# EAGLE design openTPM-v30 (EAGLE 8.1.1)
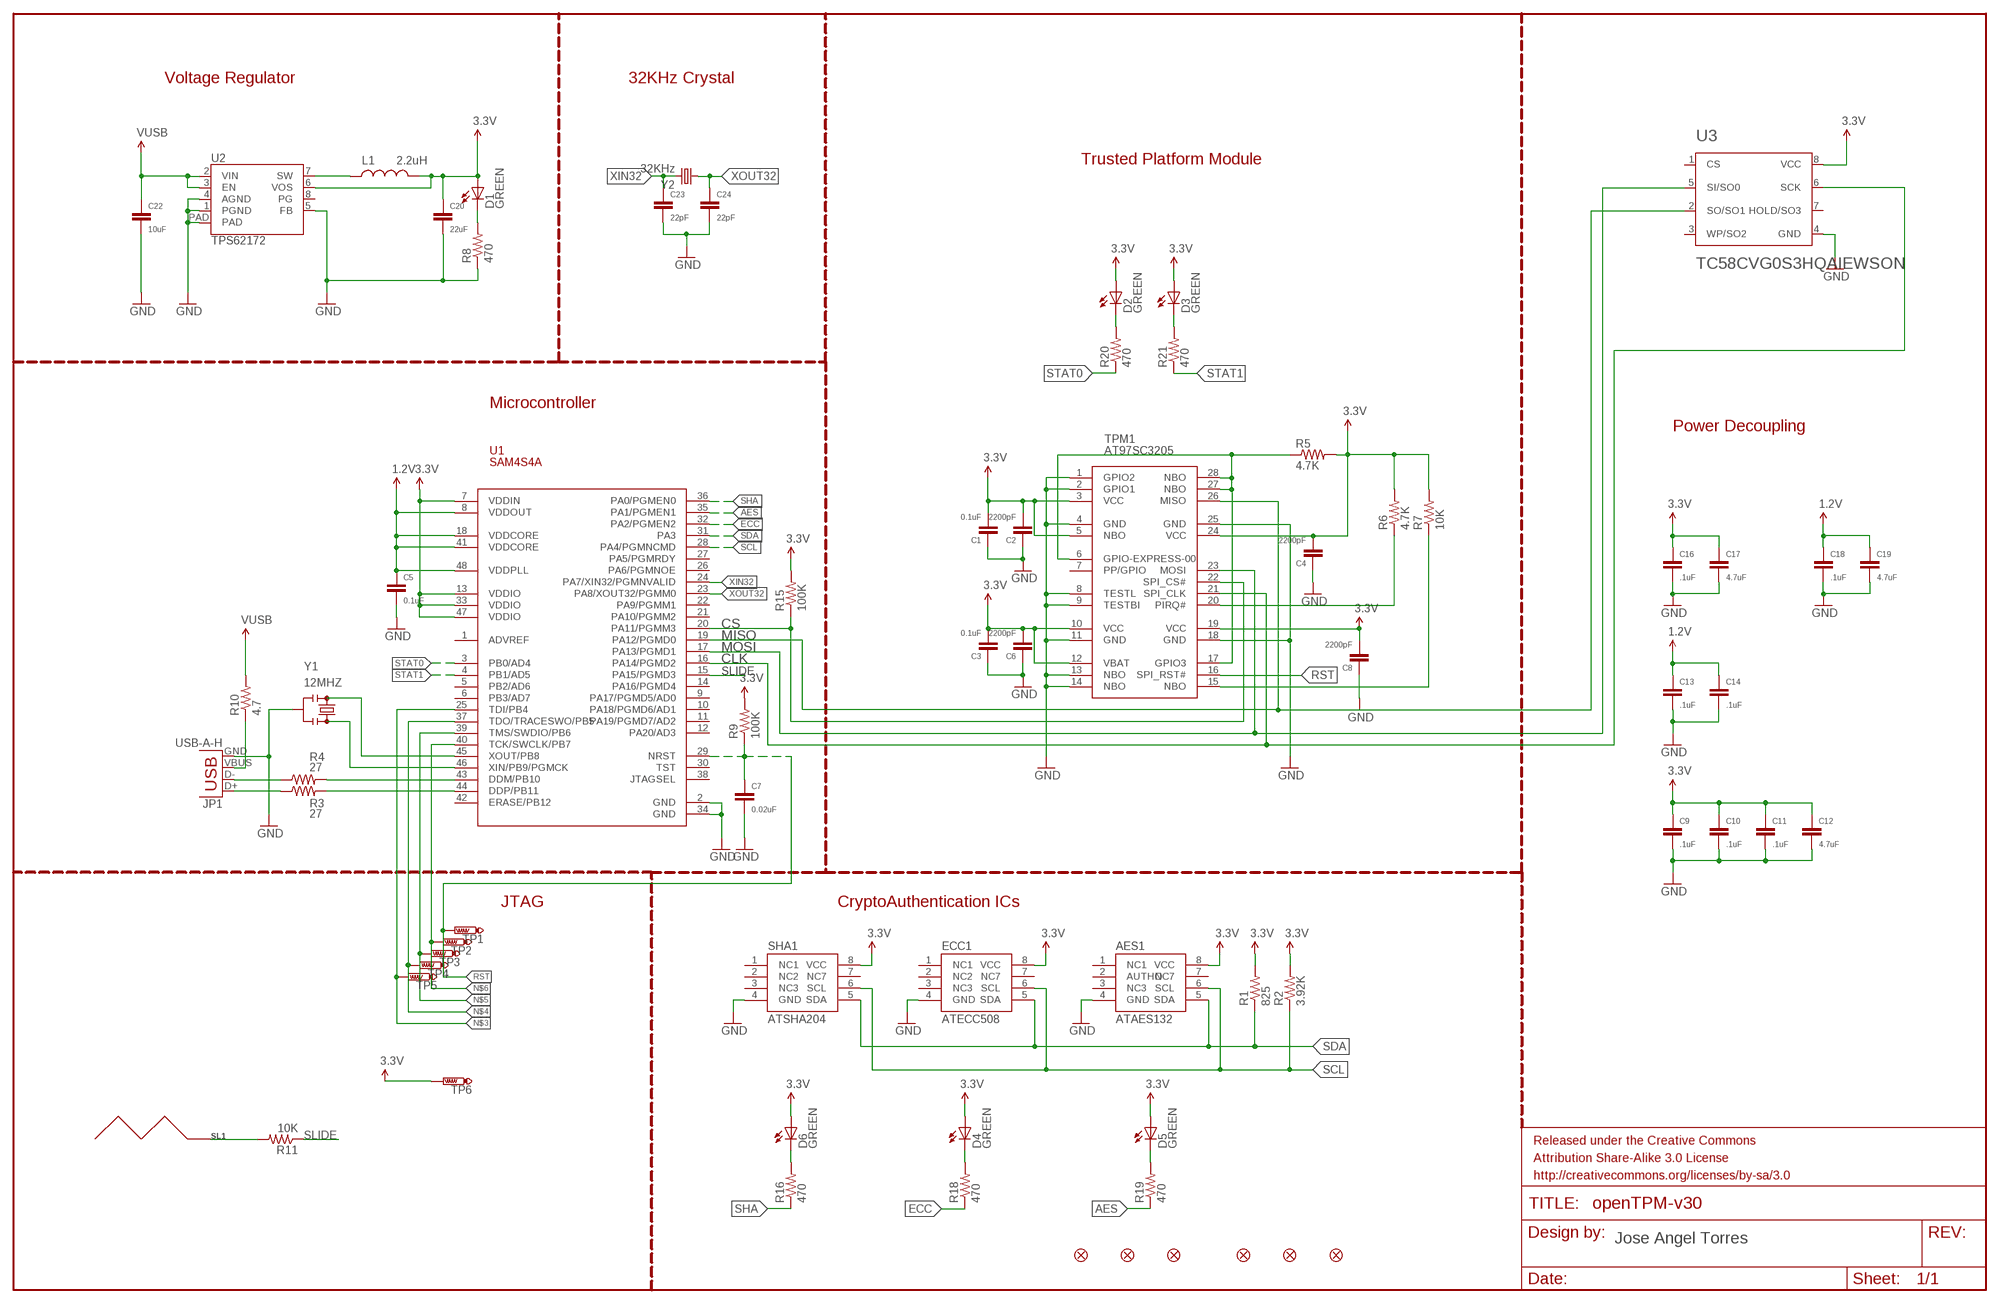
[diagram p0: schematic, sheet 1]

## Parts
AES1  ATAES132  CRYPTOTRONIX_ATAES132  [CRYPTOTRONIX_SOIC8]
C1  0.1uF  CAPACITOR.0402  [0402]
C2  2200pF  CAPACITOR.0402  [0402]
C3  0.1uF  CAPACITOR.0402  [0402]
C4  2200pF  CAPACITOR.0402  [0402]
C5  0.1uF  CAPACITOR.0402  [0402]
C6  2200pF  CAPACITOR.0402  [0402]
C7  0.02uF  CAPACITOR.0402  [0402]
C8  2200pF  CAPACITOR.0402  [0402]
C9  .1uF  CAPACITOR.0402  [0402]
C10  .1uF  CAPACITOR.0402  [0402]
C11  .1uF  CAPACITOR.0402  [0402]
C12  4.7uF  CAPACITOR.0402  [0402]
C13  .1uF  CAPACITOR.0402  [0402]
C14  .1uF  CAPACITOR.0402  [0402]
C16  .1uF  CAPACITOR.0402  [0402]
C17  4.7uF  CAPACITOR.0402  [0402]
C18  .1uF  CAPACITOR.0402  [0402]
C19  4.7uF  CAPACITOR.0402  [0402]
C20  22uF  CAPACITOR.0603  [0603]
C22  10uF  CAPACITOR.0402  [0402]
C23  22pF  CAPACITOR.0402  [0402]
C24  22pF  CAPACITOR.0402  [0402]
D1  GREEN  SPARKFUN-LED_LED-GREEN0603  [SPARKFUN-LED_LED-0603]
D2  GREEN  SPARKFUN-LED_LED-GREEN0603  [SPARKFUN-LED_LED-0603]
D3  GREEN  SPARKFUN-LED_LED-GREEN0603  [SPARKFUN-LED_LED-0603]
D4  GREEN  SPARKFUN-LED_LED-GREEN0603  [SPARKFUN-LED_LED-0603]
D5  GREEN  SPARKFUN-LED_LED-GREEN0603  [SPARKFUN-LED_LED-0603]
D6  GREEN  SPARKFUN-LED_LED-GREEN0603  [SPARKFUN-LED_LED-0603]
ECC1  ATECC508  [CRYPTOTRONIX_SOIC8]
FID1  SPARKFUN-AESTHETICS_FIDUCIAL1X2  [SPARKFUN-AESTHETICS_FIDUCIAL-1X2]
FID2  SPARKFUN-AESTHETICS_FIDUCIAL1X2  [SPARKFUN-AESTHETICS_FIDUCIAL-1X2]
FID3  SPARKFUN-AESTHETICS_FIDUCIAL1X2  [SPARKFUN-AESTHETICS_FIDUCIAL-1X2]
FID4  SPARKFUN-AESTHETICS_FIDUCIAL1X2  [SPARKFUN-AESTHETICS_FIDUCIAL-1X2]
FID5  SPARKFUN-AESTHETICS_FIDUCIAL1X2  [SPARKFUN-AESTHETICS_FIDUCIAL-1X2]
FID6  SPARKFUN-AESTHETICS_FIDUCIAL1X2  [SPARKFUN-AESTHETICS_FIDUCIAL-1X2]
JP1  USB-A-H  [USB-A-H]
L1  2.2uH  INDUCTOR0402  [C0402]
R1  825  RESISTOR.0402  [0402]
R2  3.92K  RESISTOR.0402  [0402]
R3  27  RESISTOR.0402  [0402]
R4  27  RESISTOR.0402  [0402]
R5  4.7K  RESISTOR.0402  [0402]
R6  4.7K  RESISTOR.0402  [0402]
R7  10K  RESISTOR.0402  [0402]
R8  470  RESISTOR.0402  [0402]
R9  100K  RESISTOR.0402  [0402]
R10  4.7  RESISTOR.0402  [0402]
R11  10K  RESISTOR.0402  [0402]
R15  100K  RESISTOR.0402  [0402]
R16  470  RESISTOR.0402  [0402]
R18  470  RESISTOR.0402  [0402]
R19  470  RESISTOR.0402  [0402]
R20  470  RESISTOR.0402  [0402]
R21  470  RESISTOR.0402  [0402]
SHA1  ATSHA204  CRYPTOTRONIX_ATSHA204  [CRYPTOTRONIX_SOIC8]
SL1  SLIDER_PASSIVE_1SEG  [SLIDER_PASSIVE_1SEG_12MM]
TP1  PTR1B1,27  [B1,27]
TP2  PTR1B1,27  [B1,27]
TP3  PTR1B1,27  [B1,27]
TP4  PTR1B1,27  [B1,27]
TP5  PTR1B1,27  [B1,27]
TP6  PTR1B1,27  [B1,27]
TPM1  AT97SC3205  [TSSOP28]
U1  SAM4S4A  [LQFP-48]
U2  TPS62172  [WSON-8-PAD]
U3  TC58CVG0S3HQAIEWSON  [WSON-8-PAD]
Y1  12MHZ  RESONATOR12MHZ  [RESONATOR-SMD]
Y2  32KHz  CRYSTALEPSONMC146  [CRYSTAL-32KHZ-SMD_EPSON_MC146]

## Nets
1.2V: C5.1 C13.1 C14.1 C18.1 C19.1 U1.8(VDDOUT) U1.18(VDDCORE) U1.41(VDDCORE) U1.48(VDDPLL)
3.3V: AES1.8(VCC) C1.2 C2.2 C3.2 C4.2 C6.2 C8.2 C9.1 C10.1 C11.1 C12.1 C16.1 C17.1 C20.1 D1.A D2.A D3.A D4.A D5.A D6.A ECC1.8(VCC) L1.2 R1.2 R2.2 R5.2 R6.2 R7.2 R9.2 R15.2 SHA1.8(VCC) TP6.TP TPM1.3(VCC) TPM1.5(NBO) TPM1.10(VCC) TPM1.12(VBAT) TPM1.19(VCC) TPM1.24(VCC) U1.7(VDDIN) U1.13(VDDIO) U1.33(VDDIO) U1.47(VDDIO) U2.6(VOS) U3.8(VCC)
AES: R19.1 U1.35(PA1/PGMEN1)
CLK: TPM1.21(SPI_CLK) U1.16(PA14/PGMD2) U3.6(SCK)
CS: R15.1 TPM1.22(SPI_CS#) U1.20(PA11/PGMM3)
ECC: R18.1 U1.32(PA2/PGMEN2)
GND: AES1.4(GND) C1.1 C2.1 C3.1 C4.1 C5.2 C6.1 C7.2 C8.1 C9.2 C10.2 C11.2 C12.2 C13.2 C14.2 C16.2 C17.2 C18.2 C19.2 C20.2 C22.2 C23.2 C24.2 ECC1.4(GND) JP1.GND R8.1 SHA1.4(GND) TPM1.1(GPIO2) TPM1.2(GPIO1) TPM1.4(GND) TPM1.8(TESTL) TPM1.9(TESTBI) TPM1.11(GND) TPM1.13(NBO) TPM1.14(NBO) TPM1.18(GND) TPM1.25(GND) U1.2(GND) U1.34(GND) U2.1(PGND) U2.4(AGND) U2.5(FB) U2.PAD U3.4(GND) Y1.2
MISO: TPM1.26(MISO) U1.19(PA12/PGMD0) U3.2(SO/SO1)
MOSI: TPM1.23(MOSI) U1.17(PA13/PGMD1) U3.5(SI/SO0)
N$1: R4.2 U1.43(DDM/PB10)
N$2: R3.2 U1.44(DDP/PB11)
N$3: TP5.TP U1.25(TDI/PB4)
N$4: TP4.TP U1.37(TDO/TRACESWO/PB5)
N$5: TP3.TP U1.39(TMS/SWDIO/PB6)
N$6: TP2.TP U1.40(TCK/SWCLK/PB7)
N$7: R11.2 SL1.S1(SL1)
N$8: U1.45(XOUT/PB8) Y1.1
N$9: U1.46(XIN/PB9/PGMCK) Y1.3
N$10: R6.1 TPM1.20(PIRQ#)
N$11: JP1.D- R4.1
N$12: JP1.D+ R3.1
N$13: JP1.VBUS R10.1
N$14: R7.1 TPM1.15(NBO)
N$15: R5.1 TPM1.6(GPIO-EXPRESS-00) TPM1.17(GPIO3) TPM1.27(NBO) TPM1.28(NBO)
N$16: D4.C R18.2
N$17: L1.1 U2.7(SW)
N$18: D1.C R8.2
N$20: D6.C R16.2
N$21: D5.C R19.2
N$22: D2.C R20.2
N$23: D3.C R21.2
RST: C7.1 R9.1 TP1.TP TPM1.16(SPI_RST#) U1.29(NRST)
SCL: AES1.6(SCL) ECC1.6(SCL) R2.1 SHA1.6(SCL) U1.28(PA4/PGMNCMD)
SDA: AES1.5(SDA) ECC1.5(SDA) R1.1 SHA1.5(SDA) U1.31(PA3)
SHA: R16.1 U1.36(PA0/PGMEN0)
SLIDE: R11.1 U1.15(PA15/PGMD3)
STAT0: R20.1 U1.3(PB0/AD4)
STAT1: R21.1 U1.4(PB1/AD5)
VUSB: C22.1 R10.2 U2.2(VIN) U2.3(EN)
XIN32: C23.1 U1.24(PA7/XIN32/PGMNVALID) Y2.P$1
XOUT32: C24.1 U1.23(PA8/XOUT32/PGMM0) Y2.P$2
Unconnected: AES1.1(NC1) AES1.2(AUTHO) AES1.3(NC3) AES1.7(NC7) ECC1.1(NC1) ECC1.2(NC2) ECC1.3(NC3) ECC1.7(NC7) SHA1.1(NC1) SHA1.2(NC2) SHA1.3(NC3) SHA1.7(NC7) TPM1.7(PP/GPIO) U1.1(ADVREF) U1.5(PB2/AD6) U1.6(PB3/AD7) U1.9(PA17/PGMD5/AD0) U1.10(PA18/PGMD6/AD1) U1.11(PA19/PGMD7/AD2) U1.12(PA20/AD3) U1.14(PA16/PGMD4) U1.21(PA10/PGMM2) U1.22(PA9/PGMM1) U1.26(PA6/PGMNOE) U1.27(PA5/PGMRDY) U1.30(TST) U1.38(JTAGSEL) U1.42(ERASE/PB12) U2.8(PG) U3.1(CS) U3.3(WP/SO2) U3.7(HOLD/SO3)

## Notes on the sheet
- Voltage Regulator | 32KHz Crystal
- Trusted Platform Module
- Microcontroller
- Power Decoupling
- JTAG | CryptoAuthentication ICs
- Jose Angel Torres

## Library data of the parts
AES1 = TPM:CRYPTOTRONIX_ATAES132: 32Kb Serial EEPROM. AES-128-CCM. MAC. Secure Storage for 128-bit keys. Encrypted User Memory Readn and Write. HWRNG. 2.5V to 5.5V.
C1-C14 C16-C20 C22-C24 = TPM:CAPACITOR
D1-D6 = TPM:SPARKFUN-LED_LED-GREEN: Various green LEDs 0603- DIO-00821 LARGE- DIO-00862 LILYPAD- DIO-09910; PROD_ID: DIO-00821
ECC1 = TPM:ATECC508: ATECC108: Provides ECDSA with NIST curves P256, B283, and K283. Also, a RNG, 8.5Kb EEPROM. 2.0V - 5.5V.
FID1-FID6 = TPM:SPARKFUN-AESTHETICS_FIDUCIAL: Fiducial Alignment Points Various fiducial points for machine vision alignment.
JP1 = TPM:USB: USB Connectors USB-B-PTH is fully proven SKU : PRT-00139/CONN-08278 USB-miniB is fully proven SKU : PRT-00587 USB-A-PCB is untested. USB-A-H is throughly reviewed, but untested. Spark Fun Electronics SKU : PRT-00437 USB-B-SMT is throughly reviewed, but untested. Needs silkscreen touching up. USB-A-S has not been used/tested USB-MB-H has not been used/tested USB-MICROB has been used. CONN-09505; PROD_ID: CONN-08367
L1 = TPM:INDUCTOR: Inductors Basic Inductor/Choke - 0603 and 1206. Footprints are not proven and vary greatly between part numbers. INDUCTOR POWER 3.3UH 4.0A SMD 0.197" L x 0.197" W x 0.177" H (5.00mm x 5.00mm x 4.50mm)
R1-R11 R15 R16 R18-R21 = TPM:RESISTOR
SHA1 = TPM:CRYPTOTRONIX_ATSHA204: ATSHA204
SL1 = u2ftoken:SLIDER_PASSIVE_1SEG: Slider, Passive Touch/Capacitive Sensing Type, One (1) Segment Source : http://www.PatternAgents.com Github : https://github.com/PatternAgents License : http://creativecommons.org/licenses/by-sa/3.1/ (Creative Commons 3.1) THIS SOFTWARE IS PROVIDED BY THE CONTRIBUTORS "AS IS" AND WITHOUT ANY EXPRESS OR IMPLIED WARRANTIES, INCLUDING, BUT NOT LIMITED TO, THE IMPLIED WARRANTIES OF MERCHANTABILITY AND FITNESS FOR A PARTICULAR PURPOSE ARE DISCLAIMED. IN NO EVENT SHALL THE COPYRIGHT OWNER OR CONTRIBUTORS BE LIABLE FOR ANY DIRECT, INDIRECT, INCIDENTAL, SPECIAL, EXEMPLARY, OR CONSEQUENTIAL DAMAGES (INCLUDING, BUT NOT LIMITED TO, PROCUREMENT OF SUBSTITUTE GOODS OR SERVICES; LOSS OF USE, DATA, OR PROFITS; OR BUSINESS INTERRUPTION) HOWEVER CAUSED AND ON ANY THEORY OF LIABILITY, WHETHER IN CONTRACT, STRICT LIABILITY, OR TORT (INCLUDING NEGLIGENCE OR OTHERWISE) ARISING IN ANY WAY OUT OF THE USE OF THIS SOFTWARE, EVEN IF ADVISED OF THE POSSIBILITY OF SUCH DAMAGE.
TP1-TP6 = CHEEPER-REV0.51A:PTR1: TEST PIN
TPM1 = TPM:AT97SC3205: Atmel TPM 1.2
U1 = TPM:SAM4S4A
U2 = TPM:TPS62172: Texas Instruments TPS62172 3-17V 0.5A Step-Down Converter with DCS control. Available in adjustable and fixed output voltage versions. Is packaged in an 8-pin WSON package measuring 2 × 2 mm (DSG). See a 3.3V fixed output version of this chip in action on the Electric Imp Breakout Board <https://www.sparkfun.com/products/11400>. Datasheet <http://www.ti.com/lit/gpn/tps62172>; PROD_ID: IC-11307
U3 = ALLEYBEACH_LIB:TC58CVG0S3HQAIE
Y1 = TPM:RESONATOR: Resonator Small SMD resonator. Used, eg, on the Arduino Pro/ Pro Mini boards. 8MHz- XTAL-08895 16MHz- XTAL-08900; PROD_ID: XTAL-08900; VALUE: 16MHZ
Y2 = TPM:CRYSTAL: Various standard crystals. Proven footprints.

## Board
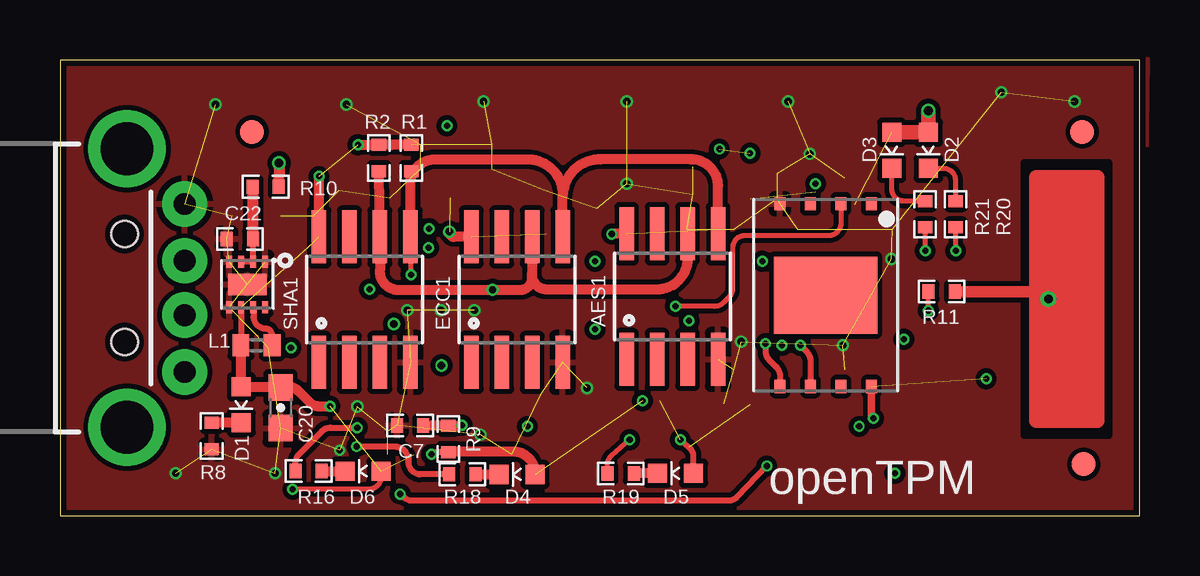
[diagram p1: board, top side]
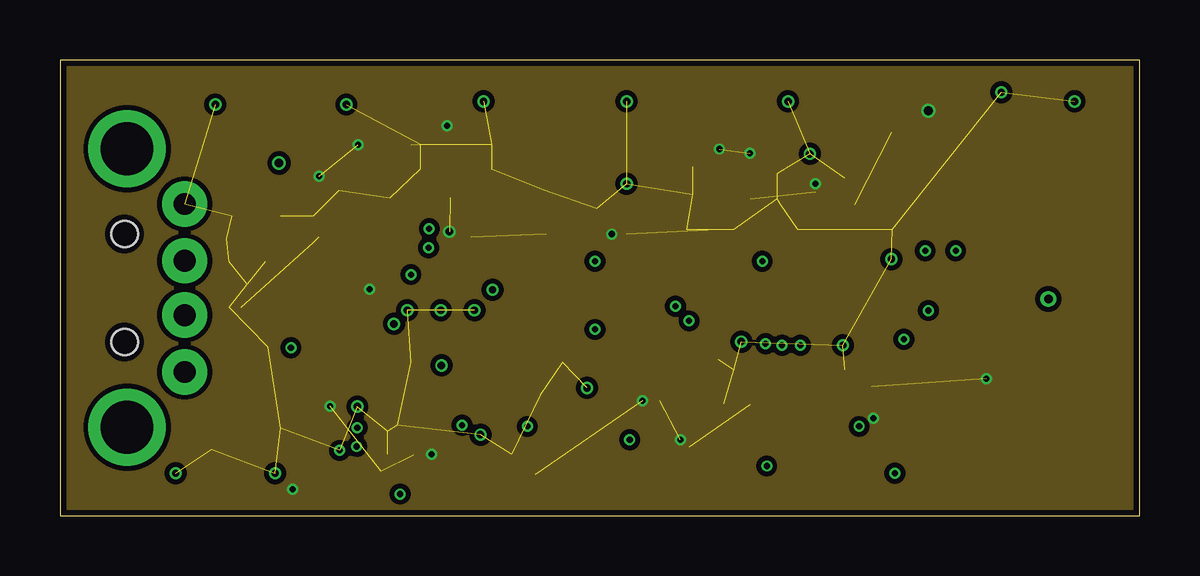
[diagram p2: board, inner layer Route2]
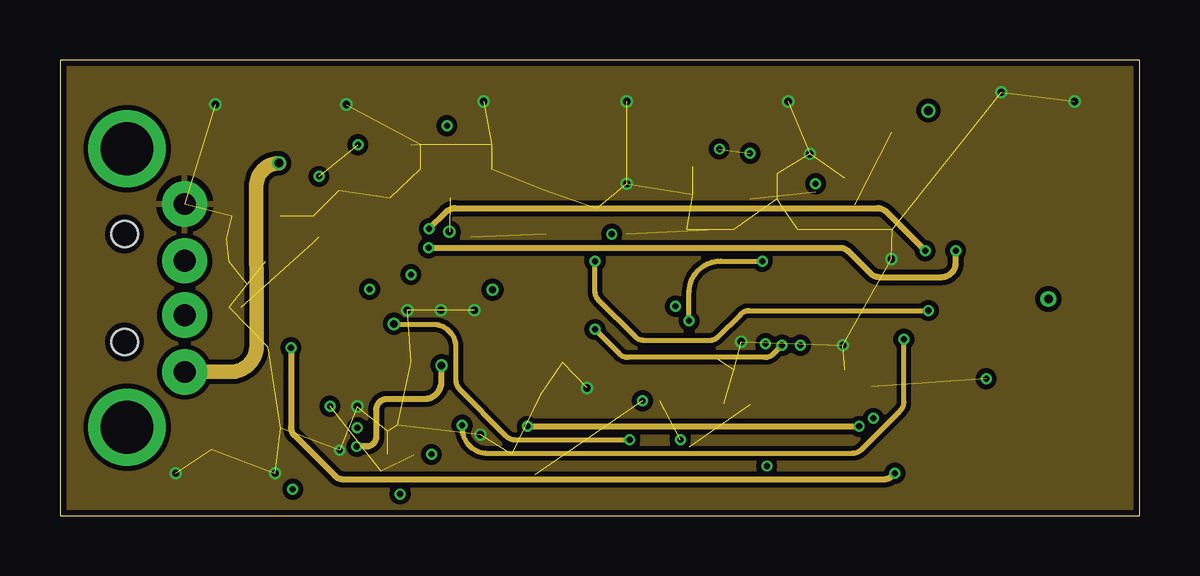
[diagram p3: board, inner layer Route15]
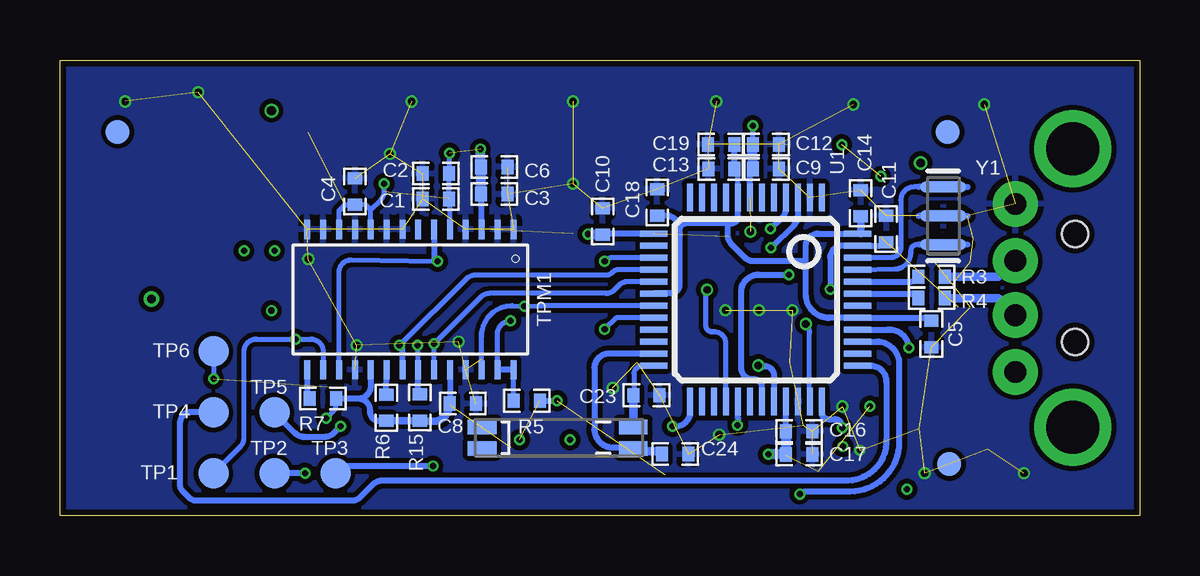
[diagram p4: board, bottom side, seen from below]

Size 45.01 x 19 mm. Coordinates in mm from the lower left corner, seen from the top.
Outline: 0,0 45.01,0 45.01,19 0,19 0,0
Copper layers (1*2*15*16): Top 0.035mm / dielectric 0.2mm / Route2 0.0175mm / dielectric 0.3mm / Route15 0.0175mm / dielectric 0.2mm / Bottom 0.035mm
Design rules "SeeedStudio_4layer_DRU_no_angle_20140221 *": minimum track width 8mil, minimum drill 10mil, track to track 8mil, track to pad 8mil, pad to pad 8mil, via to via 8mil, smd to smd 0mil, copper to edge 10mil, drill to drill 8mil, minimum pad ring 6mil, minimum via ring 4mil, stop-mask expansion 4mil, vias tented up to drill 100mil, thermal gap 10mil

### Footprints (pad centres in the part's own frame; a part is rotated, then mirrored left to right if it is on the bottom)
CRYPTOTRONIX_SOIC8 = smd 0.61 x 2.21: 1 -1.905,-2.616; 2 -0.635,-2.616; 3 0.635,-2.616; 4 1.905,-2.616; 5 1.905,2.616; 6 0.635,2.616; 7 -0.635,2.616; 8 -1.905,2.616
0402 = smd 0.5 x 0.6: 1 -0.55,0; 2 0.55,0
0603 = smd 1.1 x 1: 1 -0.85,0; 2 0.85,0
SPARKFUN-LED_LED-0603 = smd 0.8 x 0.8: A 0,-0.75; C 0,0.75
SPARKFUN-AESTHETICS_FIDUCIAL-1X2 = smd 1 x 1: 1 0,0
USB-A-H = drill 0.914 pad 1.88: D+ 2.4,1.127; D- 2.4,-1.127; GND 2.4,3.5; VBUS 2.4,-3.5 | drill 2.2: GND2 0,-5.8; GND3 0,5.8 | hole 1.1: -0.1,2.25; -0.1,-2.25
C0402 = smd 0.7 x 0.9: 1 -0.65,0; 2 0.65,0
SLIDER_PASSIVE_1SEG_12MM = drill 0.356: S1 0,-0.508
B1,27 = smd 1.27 x 1.27: TP 0,0
TSSOP28 = smd 0.8 x 0.25: 1 -2.921,4.623; 2 -2.921,3.962; 3 -2.921,3.302; 4 -2.921,2.642; 5 -2.921,1.981; 6 -2.921,1.321; 7 -2.921,0.66; 8 -2.927,0; 9 -2.921,-0.66; 10 -2.921,-1.321; 11 -2.921,-1.981; 12 -2.921,-2.642; 13 -2.921,-3.302; 14 -2.921,-3.962; 15 2.921,-3.962; 16 2.921,-3.302; 17 2.921,-2.642; 18 2.921,-1.981; 19 2.921,-1.321; 20 2.921,-0.66; 21 2.927,0; 22 2.921,0.66; 23 2.921,1.321; 24 2.921,1.981; 25 2.921,2.642; 26 2.921,3.302; 27 2.921,3.962; 28 2.921,4.623
LQFP-48 = smd 0.254 x 1.143: 1 -2.75,-4.25; 2 -2.25,-4.25; 3 -1.75,-4.25; 4 -1.25,-4.25; 5 -0.75,-4.25; 6 -0.25,-4.25; 7 0.25,-4.25; 8 0.75,-4.25; 9 1.25,-4.25; 10 1.75,-4.25; 11 2.25,-4.25; 12 2.75,-4.25; 25 2.75,4.25; 26 2.25,4.25; 27 1.75,4.25; 28 1.25,4.25; 29 0.75,4.25; 30 0.25,4.25; 31 -0.25,4.25; 32 -0.75,4.25; 33 -1.25,4.25; 34 -1.75,4.25; 35 -2.25,4.25; 36 -2.75,4.25 | smd 1.143 x 0.254: 13 4.25,-2.75; 14 4.25,-2.25; 15 4.25,-1.75; 16 4.25,-1.25; 17 4.25,-0.75; 18 4.25,-0.25; 19 4.25,0.25; 20 4.25,0.75; 21 4.25,1.25; 22 4.25,1.75; 23 4.25,2.25; 24 4.25,2.75; 37 -4.25,2.75; 38 -4.25,2.25; 39 -4.25,1.75; 40 -4.25,1.25; 41 -4.25,0.75; 42 -4.25,0.25; 43 -4.25,-0.25; 44 -4.25,-0.75; 45 -4.25,-1.25; 46 -4.25,-1.75; 47 -4.25,-2.25; 48 -4.25,-2.75
WSON-8-PAD = smd 0.25 x 0.5: 1 -0.75,-0.95; 2 -0.25,-0.95; 3 0.25,-0.95; 4 0.75,-0.95; 5 0.75,0.95; 6 0.25,0.95; 7 -0.25,0.95; 8 -0.75,0.95 | smd 1.6 x 0.9: PAD 0,0
WSON-8-PAD' = smd 0.45 x 0.55: 1 -1.905,-3.81; 2 -0.635,-3.81; 3 0.635,-3.81; 4 1.905,-3.81; 5 1.905,3.81; 6 0.635,3.81; 7 -0.635,3.81; 8 -1.905,3.81 | smd 4.3 x 3.2: PAD 0,0
RESONATOR-SMD = smd 0.45 x 1.905: 1 -1.2,0; 2 0,0; 3 1.2,0
CRYSTAL-32KHZ-SMD_EPSON_MC146 = smd 1.2 x 0.6: NC1 6.9,1.2; NC2 6.9,0.3; P$1 0.6,0.3; P$2 0.6,1.2

### Placement (x,y rotation side)
AES1  25.53,9.14 0 top
C1  29.34,13.21 0 bottom
C2  29.34,14.26 0 bottom
C3  26.91,13.41 180 bottom
C4  32.72,13.53 270 bottom
C5  8.69,7.58 270 bottom
C6  26.91,14.54 180 bottom
C7  14.59,3.77 180 top
C8  28.22,4.69 180 bottom
C9  15.58,14.47 0 bottom
C10  22.39,12.27 90 bottom
C11  10.57,11.96 90 bottom
C12  15.58,15.48 0 bottom
C13  17.44,14.47 180 bottom
C14  11.63,13.03 90 bottom
C16  14.2,3.53 0 bottom
C17  14.2,2.57 0 bottom
C18  20.12,13.07 90 bottom
C19  17.45,15.48 180 bottom
C20  9.19,4.51 270 top
C22  7.49,11.54 180 top
C23  20.56,5.03 0 bottom
C24  19.37,2.58 0 bottom
D1  7.56,4.64 180 top
D2  36.2,15.24 180 top
D3  34.67,15.24 180 top
D4  19.05,1.73 90 top
D5  25.65,1.78 90 top
D6  12.64,1.87 90 top
ECC1  19.05,9.02 0 top
FID1  42.61,16 0 top
FID2  8,16 0 top
FID3  42.67,2.16 0 top
FID4  8,16 0 bottom
FID5  7.94,2.16 0 bottom
FID6  42.61,16 0 bottom
JP1  2.79,9.5 0 top
L1  8.19,7.11 180 top
R1  14.64,14.92 90 top
R2  13.3,14.92 90 top
R3  8.67,9.97 180 bottom
R4  8.67,9.08 180 bottom
R5  25.55,4.8 0 bottom
R6  31.41,4.51 270 bottom
R7  34.05,4.89 0 bottom
R8  6.32,3.33 90 top
R9  16.18,3.21 270 top
R10  8.57,13.72 180 top
R11  36.75,9.35 0 top
R15  30.01,4.52 270 bottom
R16  10.36,1.87 0 top
R18  16.78,1.74 0 top
R19  23.37,1.78 0 top
R20  37.34,12.57 90 top
R21  36.07,12.57 90 top
SHA1  12.7,9.02 0 top
SL1  40.69,9.04 90 top
TP1  38.61,1.78 270 bottom
TP2  36.07,1.78 270 bottom
TP3  33.53,1.78 270 bottom
TP4  38.61,4.32 270 bottom
TP5  36.07,4.32 270 bottom
TP6  38.61,6.86 0 bottom
TPM1  30.73,9.02 270 bottom
U1  16,9.02 180 bottom
U2  7.81,9.65 180 top
U3  TC58CVG0S3HQAIEWSON  [WSON-8-PAD']  31.92,9.2 180 top
Y1  8.19,12.51 90 bottom
Y2  20.51,4.01 180 bottom

### Tracks (layer width: path | path; a pad name or v marks a point on that pad's centre or on a via)
1.2V
  Bottom 0.203: U1.18 arc-90 U1.18 | 8.91,8.27 C5.1 | 11.77,8.26 U1.41 | U1.8 16.75,14.14 arc-45 C13.1
  Bottom 0.254: 19.18,11.94 19.18,9.65 arc90 19.56,9.27 U1.18 | U1.41 8.91,8.27 | 13.92,10.62 13.92,11.26 arc90 13.41,11.77 U1.48 11.63,11.77 | 11.77,8.26 12.94,8.26 arc90 13.92,9.23 13.92,10.62 | U1.8 16.75,12.46 arc90 17.02,12.19 17.17,12.19 | 17.17,12.19 18.92,12.19 arc-90 19.18,11.94 | 13.92,10.62 16.1,10.62 arc45 16.46,10.77 17.02,11.33 arc45 17.17,11.69 17.17,12.19 | 16.93,14.44 C13.1 16.89,15.47 C19.1 | 19.18,11.94 arc-90 19.76,12.52 C18.1
  Bottom 0.305: C14.1 11.63,11.77
3.3V  (via drill 0.25, 0.3, 0.38)  (16 unrouted)
  Top 0.203: 9.31,5.39 C20.1 9.2,5.38 | 7.56,7.1 L1.2 7.56,7.13 | 16.18,2.69 arc-90 R9.2 | 23.04,11.76 arc90 v23,11.75 | D6.A 13.39,1.63 arc-90 12.88,1.12 v9.7,1.12 | 33.82,4.15 v33.91,4.06
  Top 0.254: U2.6 7.56,7.13 | D5.A 26.4,2.47 arc49 26.23,2.86 v25.86,3.17 | R9.2 15.72,2.66 arc45 v15.48,2.56
  Top 0.305: U3.8 33.82,4.15
  Top 0.406: 9.31,5.39 D1.A 7.56,7.1 | 16.18,2.69 18.91,2.69 arc-90 D4.A | R1.2 13.84,15.46 R2.2 v12.42,15.47 | AES1.8 23.04,11.76 | SHA1.8 v10.79,14.15 | 9.2,5.38 9.54,5.38 arc-45 9.9,5.24 10.42,4.72 arc45 10.78,4.57 v11.25,4.57 | ECC1.8 16.41,11.63 arc-90 16.26,11.79 arc45 v16.23,11.85
  Top 0.61: D3.A D2.A v36.2,16.89
  Bottom 0.203: C8.2 28.75,4.78 28.77,4.76 | 14.74,2.52 arc90 C17.1 | 14.74,4.75 arc-90 U1.33 | TPM1.5 28.75,13.2 arc-90 C1.2 C2.2 28.76,15.11 v28.77,15.11 | 16.25,14.4 arc-90 C9.1 | 16.14,15.32 arc90 C12.1 16.13,16.25 arc45 v16.13,16.26 | 27.43,13.2 arc-90 C3.2 | 10.83,11.27 C11.1 | TPM1.12 33.38,12.72 33.13,12.98 C4.2 32.28,12.98 32.05,12.75 | TPM1.10 32.05,12.75 | 32.05,12.75 31.64,13.16 arc-45 31.5,13.52 v31.5,13.84 | R7.2 33.5,4.68 arc45 33.65,4.33 v33.91,4.06 | TP6.TP v38.61,5.71
  Bottom 0.254: TPM1.24 28.75,4.78 | C16.1 14.74,4.75 | U1.7 16.25,14.4 | TPM1.19 32.05,5.41 arc90 32.58,4.89 | 32.58,4.89 R7.2 | TPM1.3 27.43,13.2 | R5.2 v24.28,4.8 | 10.83,11.27 U1.47 12.39,11.27 arc-90 12.9,10.76 v12.9,9.45 | U1.13 22.39,11.77 C10.1 | R6.2 31.7,3.96 arc90 32.08,4.34 32.08,4.39 arc-90 32.58,4.89
  Bottom 0.305: C8.2 28.77,4.63 arc90 29.46,3.94 29.98,3.94 arc90 R15.2 31.37,3.97 arc-90 R6.2
  Bottom 0.406: C16.1 14.74,2.52 | C9.1 16.14,15.32 | C17.1 v15.48,2.56 | v27.48,15.29 27.48,14.34 C6.2 C3.2 | C10.1 23,11.72 v23,11.75
  pour Route2: 0,19.05 0,0 45.09,0 45.09,1.4 45.09,19.05
AES  (via drill 0.25, 0.3)
  Top 0.203: v23.75,3.17 22.98,2.51 arc49 22.81,2.13 R19.1
  Route15 0.203: v23.75,3.17 18.96,3.17 arc-45 18.6,3.33 16.66,5.29 arc-45 16.51,5.64 16.51,7.02 arc90 15.56,7.98 13.98,7.98 arc-45 v13.92,8
  Bottom 0.203: U1.35 arc90 13.77,4.78 13.77,7.64 arc-45 v13.92,8
CLK  (via drill 0.25)
  Top 0.254: v30.86,7.11 31.14,6.84 arc-45 31.28,6.48 U3.6
  Bottom 0.203: U1.16 21.74,10.27 arc-45 22,10.13 arc45 22.24,10.03 27.7,10.03 arc-45 28.06,9.88 v30.86,7.11
  Bottom 0.254: TPM1.21 30.73,6.99 v30.86,7.11
CS  (via drill 0.25)
  Route15 0.203: v30.1,7.11 29.74,6.75 arc-45 29.38,6.6 23.68,6.6 arc-45 23.32,6.75 v22.3,7.77
  Bottom 0.203: 30.07,5.32 arc-90 R15.1 | U1.20 21.81,8.27 v22.3,7.77 | TPM1.22 30.07,7.09 v30.1,7.11
  Bottom 0.254: 30.07,5.32 TPM1.22
ECC  (via drill 0.25, 0.3)
  Top 0.254: R18.1 15.02,1.74 arc-90 14.53,2.23 14.53,2.31 arc90 13.95,2.9 v12.37,2.9
  Route15 0.254: v15.9,6.27 15.9,5.59 arc-90 15.19,4.88 13.64,4.88 arc90 13.18,4.42 13.18,3.3 arc-90 12.78,2.9 v12.37,2.9
  Bottom 0.203: U1.32 arc90 U1.32
  Bottom 0.254: v15.9,6.27 15.65,6.25 arc90 15.24,5.84 U1.32
GND  (via drill 0.25, 0.3)  (65 unrouted)
  other vias: 32.64,7.11 28.4,7.26 6.48,17.14 11.94,17.14 17.65,17.27 23.62,17.27 30.35,17.27 39.24,17.65 42.29,17.27 21.97,5.33 11.66,2.73 23.62,13.84 31.25,15.09 34.66,10.71 15.88,8.57 17.27,8.57 14.48,8.57 4.83,1.78 17.53,3.39 8.97,1.78 12.4,4.56
  pour Bottom: -0.13,19.05 45.21,19.05 45.09,0 0,0
  pour Top: 0,19.05 0,0 45.09,0 45.09,1.4 45.34,19.05
  pour Route15: 0,19.05 0,0 45.09,0 45.09,19.05
MISO  (via drill 0.25)
  Top 0.203: U3.2 32.55,12.19 arc-90 32.05,11.68 28.55,11.68 arc90 28.04,11.18 28.04,9.48 arc-45 27.89,9.12 27.66,8.89 arc-45 27.3,8.74 v25.65,8.74
  Bottom 0.203: U1.19 24.89,8.77 arc90 24.89,8.76 v25.65,8.74 26.16,8.76 arc-90 27.43,7.49 TPM1.26
MOSI  (via drill 0.25)
  Top 0.254: v29.41,7.18 29.41,6.87 arc45 29.56,6.51 29.87,6.2 arc-45 30.01,5.84 U3.5
  Bottom 0.203: U1.17 21.34,9.77 arc-45 21.7,9.62 21.9,9.42 arc45 22.26,9.27 27.11,9.27 arc-45 27.47,9.12 29.26,7.33 arc-45 29.41,6.97 | 29.41,6.97 v29.41,7.18 | TPM1.23 29.41,6.97
N$1
  Bottom 0.254: U1.43 9.53,9.27 R4.2
N$2
  Bottom 0.254: U1.44 9.5,9.77 R3.2
N$3  (via drill 0.25)
  Route15 0.254: v19.48,3.73 v33.31,3.73
  Bottom 0.203: U1.25 18.75,4.24
  Bottom 0.254: 18.75,4.24 arc90 v19.48,3.73 | TP5.TP 35.2,3.45 arc-45 34.84,3.3 33.95,3.3 arc-45 33.59,3.45 v33.31,3.73
N$4
  Bottom 0.254: U1.37 11.22,6.27 arc90 10.57,5.59 10.57,3.17 arc90 12.14,1.47 31.59,1.47 arc-45 31.95,1.32 32.49,0.78 arc45 32.85,0.64 39.29,0.64 arc45 39.65,0.78 39.88,1.02 arc45 40.01,1.32 40.01,3.85 arc45 39.86,4.21 arc45 39.6,4.32 TP4.TP
N$5  (via drill 0.25)
  Top 0.254: v29.46,2.08 28.22,0.78 arc-45 27.86,0.64 14.69,0.64 arc-45 14.33,0.78 v14.17,0.91
  Bottom 0.254: U1.39 10.95,7.27 arc90 10.03,6.35 10.03,3.1 arc90 12.06,1.02 13.93,1.02 arc-45 v14.17,0.91 | 33.42,1.88 TP3.TP 33.37,1.93 arc45 33.01,2.08 v29.46,2.08
N$6  (via drill 0.25)
  Route15 0.254: v9.63,7.01 9.63,3.72 arc45 9.78,3.36 11.46,1.67 arc45 11.82,1.52 34.33,1.52 arc45 34.69,1.67 v34.8,1.78
  Bottom 0.254: U1.40 10.51,7.77 arc90 v9.63,7.01 | v34.8,1.78 TP2.TP
N$7
  Top 0.254: SL1.S1 41.04,9.2 arc45 40.68,9.35
  Top 0.483: 40.68,9.35 R11.2
N$8
  Bottom 0.203: U1.45 10.19,10.29 arc-90 9.54,11.02 arc105 9.23,11.31 9.21,11.31
N$9
  Bottom 0.203: 9.21,13.71 9.42,13.71 arc-90 9.96,13.17 9.96,11.16 arc90 10.38,10.77 11.67,10.77 arc-90 U1.46
N$10
  Bottom 0.203: 31.4,6.08 TPM1.20
  Bottom 0.254: R6.1 31.4,6.08
N$11
  Bottom 0.356: R4.1 5.9,9.08 JP1.D-
N$12
  Bottom 0.356: R3.1 5.9,9.97 JP1.D+
N$13  (via drill 0.36)
  Top 0.457: v9.13,14.71 R10.1
  Route15 0.61: JP1.VBUS 7.09,6 arc90 8.2,7.11 8.18,13.7 arc-90 v9.13,14.71
N$14
  Bottom 0.254: TPM1.15 34.7,4.99 arc-90 R7.1
N$15  (via drill 0.25)
  Route15 0.203: v26.23,8.13 26.23,9.35 arc-90 27.55,10.62 v29.27,10.62
  Bottom 0.203: R5.1 TPM1.28 | TPM1.27 26.77,7.58 arc90 v26.23,8.13 | 29.4,11.93 arc-90 TPM1.6 | TPM1.17 33.38,10.16 arc90 32.87,10.67 v29.27,10.62
  Bottom 0.254: TPM1.28 TPM1.27 | v29.27,10.62 29.34,10.67 29.4,10.73 29.4,11.93
N$16
  Top 0.203: 18.31,1.74 D4.C
  Top 0.406: R18.2 18.31,1.74
N$17
  Top 0.203: U2.7 | 8.83,7.13 L1.1
  Top 0.254: U2.7 8.06,8.32 arc90 8.57,7.81 arc-90 8.83,7.56 8.83,7.13
N$18
  Top 0.203: 6.38,3.88 R8.2
  Top 0.406: D1.C 6.38,3.88
N$20
  Top 0.406: R16.2 D6.C
N$21
  Top 0.406: D5.C R19.2
N$22
  Top 0.203: R20.2 37.34,13.97 arc90 36.83,14.48 36.21,14.48 D2.C
N$23
  Top 0.203: R21.2 35.18,13.12 arc-90 34.67,13.63 D3.C
RST  (via drill 0.25)
  Top 0.203: 16.08,3.78 R9.1 | 16.76,3.77 v16.76,3.79
  Top 0.406: C7.1 16.08,3.78 | R9.1 16.76,3.77
  Route15 0.203: v16.76,3.79 arc90 17.73,2.62 33.04,2.62 arc45 33.4,2.77 35.03,4.39 arc45 35.18,4.75 v35.18,7.37
  Bottom 0.203: TPM1.16 34.04,6.86 arc-90 34.54,7.37 v35.18,7.37 36.83,7.37 arc-90 37.34,6.86 37.34,3.26 arc45 37.49,2.9 TP1.TP
  Bottom 0.254: v16.76,3.79 16.76,3.86 16.75,4.1 U1.29
SCL  (via drill 0.3)
  Top 0.203: 13.31,14.28 arc-90 R2.1
  Top 0.254: 26.16,10.92 AES1.6
  Top 0.406: 19.68,10.13 arc90 20.19,9.45 25.03,9.45 arc90 26.16,10.92 | 19.68,10.13 19.68,9.89 arc-90 19.15,9.42 v18.03,9.42 14.03,9.42 arc-90 13.34,10.25 SHA1.6 13.31,14.28 | ECC1.6 19.68,10.13
  Bottom 0.203: U1.28 17.25,7.19 arc-90 17.73,7.67 17.83,7.67 arc90 18.09,7.92 18.09,9.4 arc90 v18.03,9.42
SDA  (via drill 0.25)
  Top 0.203: R1.1 14.61,13.85 arc-90 14.61,13.84 | v14.63,10.06 14.63,11.61 arc90 SHA1.5
  Top 0.406: AES1.5 27.43,13.78 arc90 26.29,14.86 22.54,14.86 arc90 20.95,13.34 | SHA1.5 14.61,13.84 arc-90 15.62,14.86 19.56,14.86 arc-90 20.95,13.34 | ECC1.5 20.95,13.34
  Bottom 0.254: U1.31 15.75,5.39 arc-90 16.05,5.69 16.1,5.69 arc90 16.61,6.15 16.61,9.35 arc90 15.88,10.06 v14.63,10.06
SHA  (via drill 0.25)
  Top 0.203: R16.1 arc90 R16.1 9.82,2.1
  Top 0.254: R16.1 9.81,2.21 arc-45 9.96,2.57 10.93,3.53 arc-45 11.29,3.68 v12.39,3.68
  Bottom 0.254: U1.36 13.25,4.31 arc-90 13.01,4.04 12.72,4.04 arc90 v12.39,3.68
SLIDE  (via drill 0.25)
  Top 0.203: v36.2,8.56 arc45 36.2,8.58 R11.1
  Route15 0.203: v36.2,8.56 28.73,8.56 arc45 28.38,8.41 27.43,7.46 arc-45 27.07,7.32 24.34,7.32 arc-45 23.98,7.46 22.45,8.99 arc-45 22.3,9.35 v22.3,10.62
  Bottom 0.203: U1.15 22,10.77 arc-45 v22.3,10.62
STAT0  (via drill 0.25)
  Top 0.203: v37.34,11.05 R20.1
  Route15 0.254: v15.37,11.18 32.51,11.18 arc-45 32.86,11.03 33.79,10.11 arc45 34.15,9.96 36.77,9.96 arc45 37.13,10.11 37.19,10.16 arc45 37.34,10.52 v37.34,11.05
  Bottom 0.254: U1.3 14.25,12.5 arc45 14.4,12.14 v15.37,11.18
STAT1  (via drill 0.25)
  Top 0.203: v36.07,11.05 R21.1
  Route15 0.254: v15.39,11.96 16.11,12.68 arc-45 16.47,12.83 34.08,12.83 arc-45 34.44,12.68 v36.07,11.05
  Bottom 0.203: 14.73,13.29 U1.4
  Bottom 0.254: U1.4 14.75,12.79 arc46 14.91,12.43 v15.39,11.96
VUSB
  Top 0.203: 8.04,13.57 arc90 R10.2 | C22.1 8.04,11.63 arc90 8.06,11.61
  Top 0.254: U2.3 U2.2 8.06,11.61
  Top 0.457: C22.1 8.04,13.57
XIN32
  Bottom 0.203: 21.11,4.96 arc90 C23.1 arc-90 21.08,4.99 21.08,5.96 arc90 20.67,6.27 U1.24
  Bottom 0.356: Y2.P$1 21.11,4.96
XOUT32
  Bottom 0.203: 21.12,2.86 arc-90 Y2.P$2
  Bottom 0.254: U1.23 22.12,6.77 arc-90 22.73,6.16 22.73,3.62 arc-90 21.97,2.86 21.12,2.86 | C24.1 arc-90 20.03,2.69 | 20.6,2.69 arc-90 20.72,2.81 Y2.P$2
  Bottom 0.356: 20.03,2.69 20.6,2.69

### Text on the board
tNames: openTPM